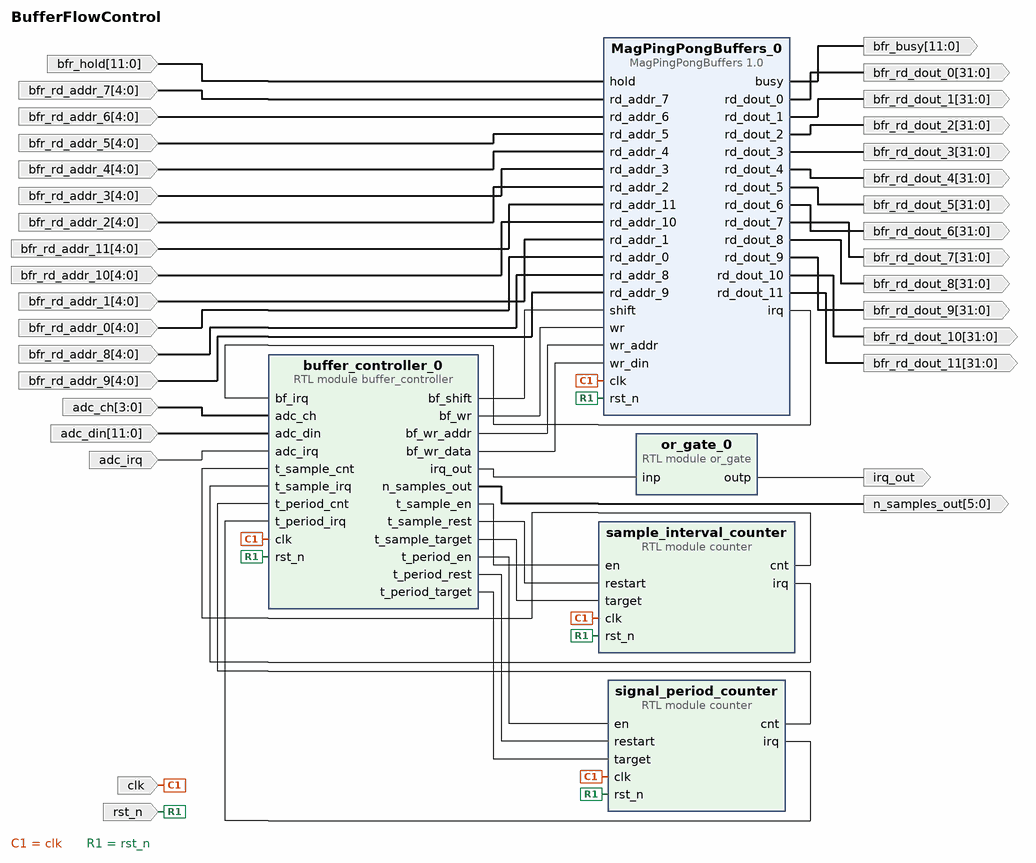
[diagram p0: block diagram of the top level]
# Vivado block design BufferFlowControl, xczu3eg-sbva484-1-i, Vivado 2020.2
create_bd_design BufferFlowControl

create_bd_port -dir I -from 3 -to 0 adc_ch
create_bd_port -dir I -from 11 -to 0 adc_din
create_bd_port -dir I -type intr adc_irq
create_bd_port -dir O -from 11 -to 0 bfr_busy
create_bd_port -dir I -type clk clk
create_bd_port -dir I -from 11 -to 0 bfr_hold
create_bd_port -dir O irq_out
create_bd_port -dir O -from 5 -to 0 n_samples_out
create_bd_port -dir I -type rst rst_n
create_bd_port -dir I -from 4 -to 0 bfr_rd_addr_7
create_bd_port -dir I -from 4 -to 0 bfr_rd_addr_6
create_bd_port -dir I -from 4 -to 0 bfr_rd_addr_5
create_bd_port -dir I -from 4 -to 0 bfr_rd_addr_4
create_bd_port -dir I -from 4 -to 0 bfr_rd_addr_3
create_bd_port -dir I -from 4 -to 0 bfr_rd_addr_2
create_bd_port -dir I -from 4 -to 0 bfr_rd_addr_11
create_bd_port -dir I -from 4 -to 0 bfr_rd_addr_10
create_bd_port -dir I -from 4 -to 0 bfr_rd_addr_1
create_bd_port -dir I -from 4 -to 0 bfr_rd_addr_0
create_bd_port -dir I -from 4 -to 0 bfr_rd_addr_8
create_bd_port -dir I -from 4 -to 0 bfr_rd_addr_9
create_bd_port -dir O -from 31 -to 0 bfr_rd_dout_8
create_bd_port -dir O -from 31 -to 0 bfr_rd_dout_7
create_bd_port -dir O -from 31 -to 0 bfr_rd_dout_6
create_bd_port -dir O -from 31 -to 0 bfr_rd_dout_5
create_bd_port -dir O -from 31 -to 0 bfr_rd_dout_4
create_bd_port -dir O -from 31 -to 0 bfr_rd_dout_3
create_bd_port -dir O -from 31 -to 0 bfr_rd_dout_2
create_bd_port -dir O -from 31 -to 0 bfr_rd_dout_11
create_bd_port -dir O -from 31 -to 0 bfr_rd_dout_10
create_bd_port -dir O -from 31 -to 0 bfr_rd_dout_1
create_bd_port -dir O -from 31 -to 0 bfr_rd_dout_0
create_bd_port -dir O -from 31 -to 0 bfr_rd_dout_9

create_bd_cell -type module -reference or_gate or_gate_0
create_bd_cell -type module -reference counter sample_interval_counter
set_property -dict {CONFIG.auto_rst {"0"} CONFIG.n_bits 20} [get_bd_cells sample_interval_counter]
create_bd_cell -type module -reference counter signal_period_counter
set_property -dict {CONFIG.auto_rst {"0"} CONFIG.n_bits 21} [get_bd_cells signal_period_counter]
create_bd_cell -type ip -vlnv DIII:PL-Mag-Sensor:MagPingPongBuffers:1.0 MagPingPongBuffers_0
create_bd_cell -type module -reference buffer_controller buffer_controller_0
set_property -dict [list \
  CONFIG.bf_addr_n_bits 5 \
  CONFIG.t_period_target_val 2000000 \
  CONFIG.t_sample_target_val 100000 \
] [get_bd_cells buffer_controller_0]

# ---- connections ----

connect_bd_net -net BufferFlowControl_irq_out [get_bd_pins buffer_controller_0/irq_out] [get_bd_pins or_gate_0/inp]
connect_bd_net -net BufferFlowControl_n_samples_out [get_bd_pins buffer_controller_0/n_samples_out] [get_bd_ports n_samples_out]
connect_bd_net [get_bd_ports adc_ch] [get_bd_pins buffer_controller_0/adc_ch]
connect_bd_net [get_bd_ports adc_din] [get_bd_pins buffer_controller_0/adc_din]
connect_bd_net [get_bd_ports adc_irq] [get_bd_pins buffer_controller_0/adc_irq]
connect_bd_net [get_bd_pins buffer_controller_0/t_period_en] [get_bd_pins signal_period_counter/en]
connect_bd_net [get_bd_pins buffer_controller_0/t_period_rest] [get_bd_pins signal_period_counter/restart]
connect_bd_net [get_bd_pins buffer_controller_0/t_period_target] [get_bd_pins signal_period_counter/target]
connect_bd_net [get_bd_pins buffer_controller_0/t_sample_en] [get_bd_pins sample_interval_counter/en]
connect_bd_net [get_bd_pins buffer_controller_0/t_sample_rest] [get_bd_pins sample_interval_counter/restart]
connect_bd_net [get_bd_pins buffer_controller_0/t_sample_target] [get_bd_pins sample_interval_counter/target]
connect_bd_net -net clk_0_1 [get_bd_ports clk] \
  [get_bd_pins signal_period_counter/clk] [get_bd_pins sample_interval_counter/clk] [get_bd_pins MagPingPongBuffers_0/clk] \
  [get_bd_pins buffer_controller_0/clk]
connect_bd_net [get_bd_pins or_gate_0/outp] [get_bd_ports irq_out]
connect_bd_net -net rst_n_0_1 [get_bd_ports rst_n] \
  [get_bd_pins signal_period_counter/rst_n] [get_bd_pins sample_interval_counter/rst_n] \
  [get_bd_pins MagPingPongBuffers_0/rst_n] [get_bd_pins buffer_controller_0/rst_n]
connect_bd_net [get_bd_pins sample_interval_counter/cnt] [get_bd_pins buffer_controller_0/t_sample_cnt]
connect_bd_net [get_bd_pins sample_interval_counter/irq] [get_bd_pins buffer_controller_0/t_sample_irq]
connect_bd_net -net signal_period_timer_cnt [get_bd_pins signal_period_counter/cnt] [get_bd_pins buffer_controller_0/t_period_cnt]
connect_bd_net -net signal_period_timer_irq [get_bd_pins signal_period_counter/irq] [get_bd_pins buffer_controller_0/t_period_irq]
connect_bd_net -net hold_1 [get_bd_ports bfr_hold] [get_bd_pins MagPingPongBuffers_0/hold]
connect_bd_net -net rd_addr_7_0_1 [get_bd_ports bfr_rd_addr_7] [get_bd_pins MagPingPongBuffers_0/rd_addr_7]
connect_bd_net -net rd_addr_6_0_1 [get_bd_ports bfr_rd_addr_6] [get_bd_pins MagPingPongBuffers_0/rd_addr_6]
connect_bd_net -net rd_addr_5_0_1 [get_bd_ports bfr_rd_addr_5] [get_bd_pins MagPingPongBuffers_0/rd_addr_5]
connect_bd_net -net rd_addr_4_0_1 [get_bd_ports bfr_rd_addr_4] [get_bd_pins MagPingPongBuffers_0/rd_addr_4]
connect_bd_net -net rd_addr_3_0_1 [get_bd_ports bfr_rd_addr_3] [get_bd_pins MagPingPongBuffers_0/rd_addr_3]
connect_bd_net -net rd_addr_2_0_1 [get_bd_ports bfr_rd_addr_2] [get_bd_pins MagPingPongBuffers_0/rd_addr_2]
connect_bd_net -net rd_addr_11_0_1 [get_bd_ports bfr_rd_addr_11] [get_bd_pins MagPingPongBuffers_0/rd_addr_11]
connect_bd_net -net rd_addr_10_0_1 [get_bd_ports bfr_rd_addr_10] [get_bd_pins MagPingPongBuffers_0/rd_addr_10]
connect_bd_net -net rd_addr_1_0_1 [get_bd_ports bfr_rd_addr_1] [get_bd_pins MagPingPongBuffers_0/rd_addr_1]
connect_bd_net -net rd_addr_0_0_1 [get_bd_ports bfr_rd_addr_0] [get_bd_pins MagPingPongBuffers_0/rd_addr_0]
connect_bd_net -net rd_addr_8_0_1 [get_bd_ports bfr_rd_addr_8] [get_bd_pins MagPingPongBuffers_0/rd_addr_8]
connect_bd_net -net rd_addr_9_0_1 [get_bd_ports bfr_rd_addr_9] [get_bd_pins MagPingPongBuffers_0/rd_addr_9]
connect_bd_net [get_bd_pins buffer_controller_0/bf_shift] [get_bd_pins MagPingPongBuffers_0/shift]
connect_bd_net [get_bd_pins buffer_controller_0/bf_wr] [get_bd_pins MagPingPongBuffers_0/wr]
connect_bd_net [get_bd_pins buffer_controller_0/bf_wr_addr] [get_bd_pins MagPingPongBuffers_0/wr_addr]
connect_bd_net [get_bd_pins buffer_controller_0/bf_wr_data] [get_bd_pins MagPingPongBuffers_0/wr_din]
connect_bd_net [get_bd_pins MagPingPongBuffers_0/busy] [get_bd_ports bfr_busy]
connect_bd_net [get_bd_pins MagPingPongBuffers_0/irq] [get_bd_pins buffer_controller_0/bf_irq]
connect_bd_net [get_bd_pins MagPingPongBuffers_0/rd_dout_8] [get_bd_ports bfr_rd_dout_8]
connect_bd_net [get_bd_pins MagPingPongBuffers_0/rd_dout_7] [get_bd_ports bfr_rd_dout_7]
connect_bd_net [get_bd_pins MagPingPongBuffers_0/rd_dout_6] [get_bd_ports bfr_rd_dout_6]
connect_bd_net [get_bd_pins MagPingPongBuffers_0/rd_dout_5] [get_bd_ports bfr_rd_dout_5]
connect_bd_net [get_bd_pins MagPingPongBuffers_0/rd_dout_4] [get_bd_ports bfr_rd_dout_4]
connect_bd_net [get_bd_pins MagPingPongBuffers_0/rd_dout_3] [get_bd_ports bfr_rd_dout_3]
connect_bd_net [get_bd_pins MagPingPongBuffers_0/rd_dout_2] [get_bd_ports bfr_rd_dout_2]
connect_bd_net [get_bd_pins MagPingPongBuffers_0/rd_dout_11] [get_bd_ports bfr_rd_dout_11]
connect_bd_net [get_bd_pins MagPingPongBuffers_0/rd_dout_10] [get_bd_ports bfr_rd_dout_10]
connect_bd_net [get_bd_pins MagPingPongBuffers_0/rd_dout_1] [get_bd_ports bfr_rd_dout_1]
connect_bd_net [get_bd_pins MagPingPongBuffers_0/rd_dout_0] [get_bd_ports bfr_rd_dout_0]
connect_bd_net [get_bd_pins MagPingPongBuffers_0/rd_dout_9] [get_bd_ports bfr_rd_dout_9]

validate_bd_design
save_bd_design
